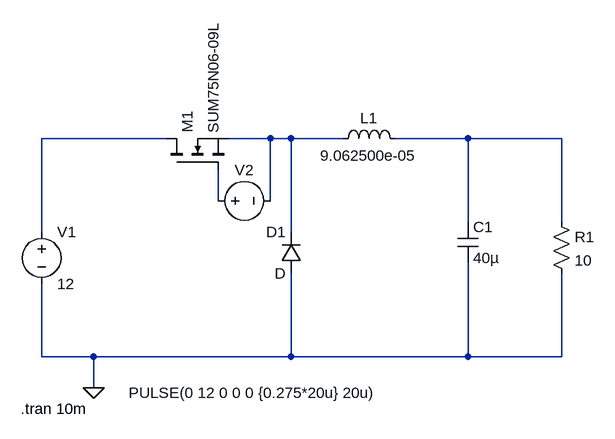
[diagram p0: schematic Guc elektronigi buck.asc]
Guc elektronigi buck.asc, the LTspice schematic file:
Version 4
SHEET 1 880 680
WIRE -224 -16 -416 -16
WIRE -64 -16 -128 -16
WIRE -32 -16 -64 -16
WIRE 48 -16 -32 -16
WIRE 240 -16 128 -16
WIRE 384 -16 240 -16
WIRE -144 80 -144 32
WIRE -64 80 -64 -16
WIRE 240 112 240 -16
WIRE 384 112 384 -16
WIRE -416 128 -416 -16
WIRE -32 128 -32 -16
WIRE -416 320 -416 208
WIRE -336 320 -416 320
WIRE -32 320 -32 192
WIRE -32 320 -336 320
WIRE 240 320 240 176
WIRE 240 320 -32 320
WIRE 384 320 384 192
WIRE 384 320 240 320
WIRE -336 368 -336 320
FLAG -336 368 0
SYMBOL nmos -224 32 R270
SYMATTR InstName M1
SYMATTR Value SUM75N06-09L
SYMBOL voltage -416 112 R0
WINDOW 123 0 0 Left 0
WINDOW 39 0 0 Left 0
SYMATTR InstName V1
SYMATTR Value 12
SYMBOL diode -16 192 R180
WINDOW 0 24 64 Left 2
WINDOW 3 24 0 Left 2
SYMATTR InstName D1
SYMBOL ind 32 0 R270
WINDOW 0 32 56 VTop 2
WINDOW 3 5 56 VBottom 2
SYMATTR InstName L1
SYMATTR Value 9.062500e-05
SYMBOL res 368 96 R0
SYMATTR InstName R1
SYMATTR Value 10
SYMBOL cap 224 112 R0
SYMATTR InstName C1
SYMATTR Value 40µ
SYMBOL voltage -160 80 R270
WINDOW 0 32 56 VTop 2
WINDOW 3 -280 70 VBottom 2
WINDOW 123 0 0 Left 0
WINDOW 39 0 0 Left 0
SYMATTR InstName V2
SYMATTR Value PULSE(0 12 0 0 0 {0.275*20u} 20u)
TEXT -448 400 Left 2 !.tran 10m

The netlist it stands for:
* Guc elektronigi buck.asc
M1 N001 N004 N002 N002 SUM75N06-09L
V1 N001 0 12
D1 0 N002 D
L1 N002 N003 9.062500e-05
R1 N003 0 10
C1 N003 0 40µ
V2 N004 N002 PULSE(0 12 0 0 0 {0.275*20u} 20u)
.model D D
.lib standard.dio
.model NMOS NMOS
.model PMOS PMOS
.lib standard.mos
.tran 10m
.backanno
.end